# Altium schematic sheet master.SchDoc
size A4
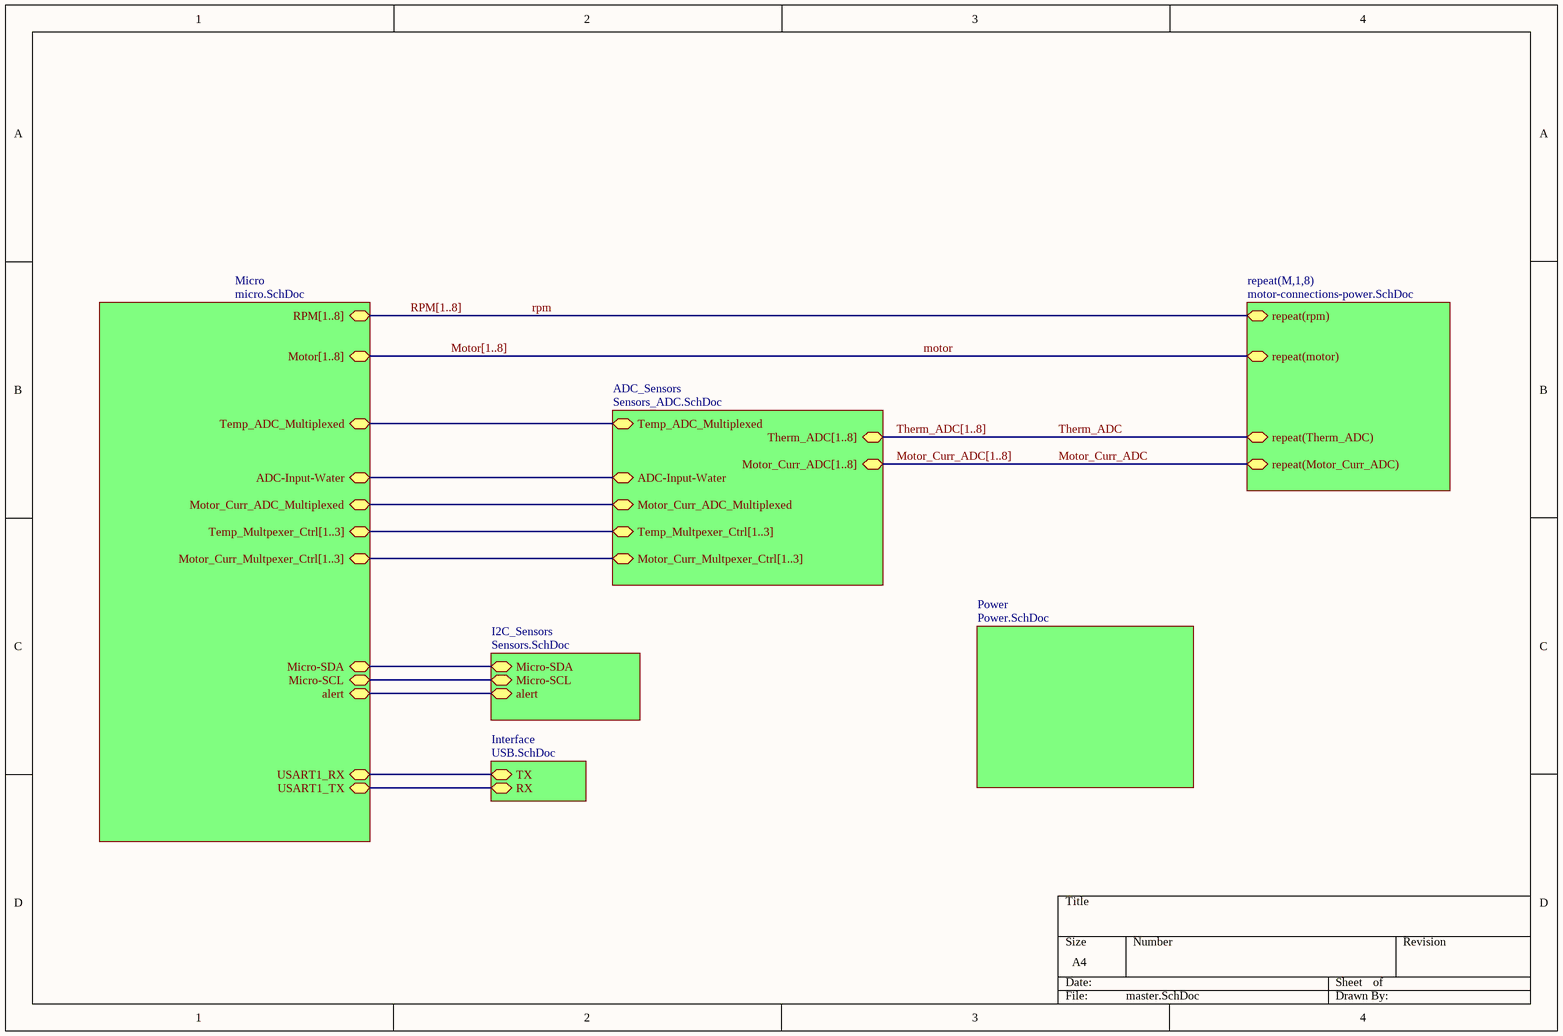
[diagram p0: master.SchDoc]

## Sub-sheets
ADC_Sensors = Sensors_ADC.SchDoc: ADC-Input-Water, Motor_Curr_ADC[1..8], Therm_ADC[1..8], Temp_ADC_Multiplexed, Motor_Curr_ADC_Multiplexed, Temp_Multpexer_Ctrl[1..3], Motor_Curr_Multpexer_Ctrl[1..3]
I2C_Sensors = Sensors.SchDoc: Micro-SDA, Micro-SCL, alert
Interface = USB.SchDoc: TX, RX
Micro = micro.SchDoc: RPM[1..8], USART1_RX, USART1_TX, Micro-SDA, Micro-SCL, Motor[1..8], alert, ADC-Input-Water, Temp_ADC_Multiplexed, Motor_Curr_ADC_Multiplexed, Temp_Multpexer_Ctrl[1..3], Motor_Curr_Multpexer_Ctrl[1..3]
Power = Power.SchDoc: no entries
repeat(M,1,8) = motor-connections-power.SchDoc: repeat(rpm), repeat(motor), repeat(Motor_Curr_ADC), repeat(Therm_ADC)

## Nets
motor: sheet repeat(M,1,8)/repeat(motor)
Motor_Curr_ADC: sheet repeat(M,1,8)/repeat(Motor_Curr_ADC)
rpm: sheet repeat(M,1,8)/repeat(rpm)
Therm_ADC: sheet repeat(M,1,8)/repeat(Therm_ADC)
(unnamed): sheet Micro/USART1_RX, sheet Interface/TX
(unnamed): sheet Micro/USART1_TX, sheet Interface/RX
(unnamed): sheet Micro/Micro-SDA, sheet I2C_Sensors/Micro-SDA
(unnamed): sheet Micro/Micro-SCL, sheet I2C_Sensors/Micro-SCL
(unnamed): sheet Micro/alert, sheet I2C_Sensors/alert
(unnamed): sheet Micro/ADC-Input-Water, sheet ADC_Sensors/ADC-Input-Water
(unnamed): sheet Micro/Temp_ADC_Multiplexed, sheet ADC_Sensors/Temp_ADC_Multiplexed
(unnamed): sheet Micro/Motor_Curr_ADC_Multiplexed, sheet ADC_Sensors/Motor_Curr_ADC_Multiplexed

## Buses and harness runs
bus Motor[1..8] = sheet Micro/Motor[1..8]
bus Motor_Curr_ADC[1..8] = sheet ADC_Sensors/Motor_Curr_ADC[1..8]
bus RPM[1..8] = sheet Micro/RPM[1..8]
bus sheet ADC_Sensors/Motor_Curr_Multpexer_Ctrl[1..3] = sheet Micro/Motor_Curr_Multpexer_Ctrl[1..3]
bus sheet ADC_Sensors/Temp_Multpexer_Ctrl[1..3] = sheet Micro/Temp_Multpexer_Ctrl[1..3]
bus Therm_ADC[1..8] = sheet ADC_Sensors/Therm_ADC[1..8]